# EAGLE design stepper_driver2 (EAGLE 6.4)
stepper conroller with 2 counting bits for unipolar stepper motor
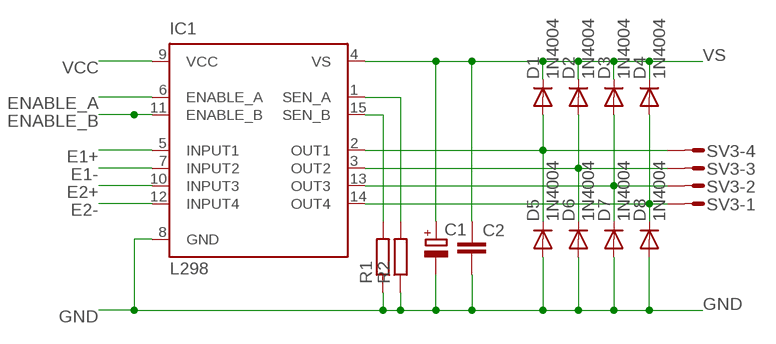
[diagram p0: schematic, sheet 1]

## Parts
C1  CPOL-EUE3.5-10  [E3,5-10]
C2  C-EU050-025X075  [C050-025X075]
D1  1N4004  [DO41-10]
D2  1N4004  [DO41-10]
D3  1N4004  [DO41-10]
D4  1N4004  [DO41-10]
D5  1N4004  [DO41-10]
D6  1N4004  [DO41-10]
D7  1N4004  [DO41-10]
D8  1N4004  [DO41-10]
IC1  L298  [MULTIWATT-15]
R1  R-EU_0207/15  [0207/15]
R2  R-EU_0207/15  [0207/15]
SV3  S04P  [S04P]

## Nets
A1+: D1.A D5.C IC1.2(OUT1) SV3.4
A1-: D2.A D6.C IC1.3(OUT2) SV3.3
A2+: D3.A D7.C IC1.13(OUT3) SV3.2
A2-: D4.A D8.C IC1.14(OUT4) SV3.1
E1+: IC1.5(INPUT1)
E1-: IC1.7(INPUT2)
E2+: IC1.10(INPUT3)
E2-: IC1.12(INPUT4)
ENABLE_A: IC1.6(ENABLE_A)
ENABLE_B: IC1.11(ENABLE_B)
GND: C1.- C2.2 D5.A D6.A D7.A D8.A IC1.8(GND) R1.1 R2.1
N$6: IC1.15(SEN_B) R1.2
N$7: IC1.1(SEN_A) R2.2
VCC: IC1.9(VCC)
VS: C1.+ C2.1 D1.C D2.C D3.C D4.C IC1.4(VS)

## Library data of the parts
C1 = rcl:CPOL-EU: POLARIZED CAPACITOR, European symbol
C2 = rcl:C-EU: CAPACITOR, European symbol
D1-D8 = diode:1N4004: DIODE general purpose rectifier, 1 A
IC1 = st-microelectronics:L298: DUAL FULL-BRIDGE DRIVER; MPN: L298N; OC_FARNELL: 1589425; OC_NEWARK: 32M1527
R1 R2 = rcl:R-EU_: RESISTOR, European symbol
SV3 = con-amp-mt:S04P: AMP MT CONNECTOR; OC_FARNELL: unknown; OC_NEWARK: unknown

## Board
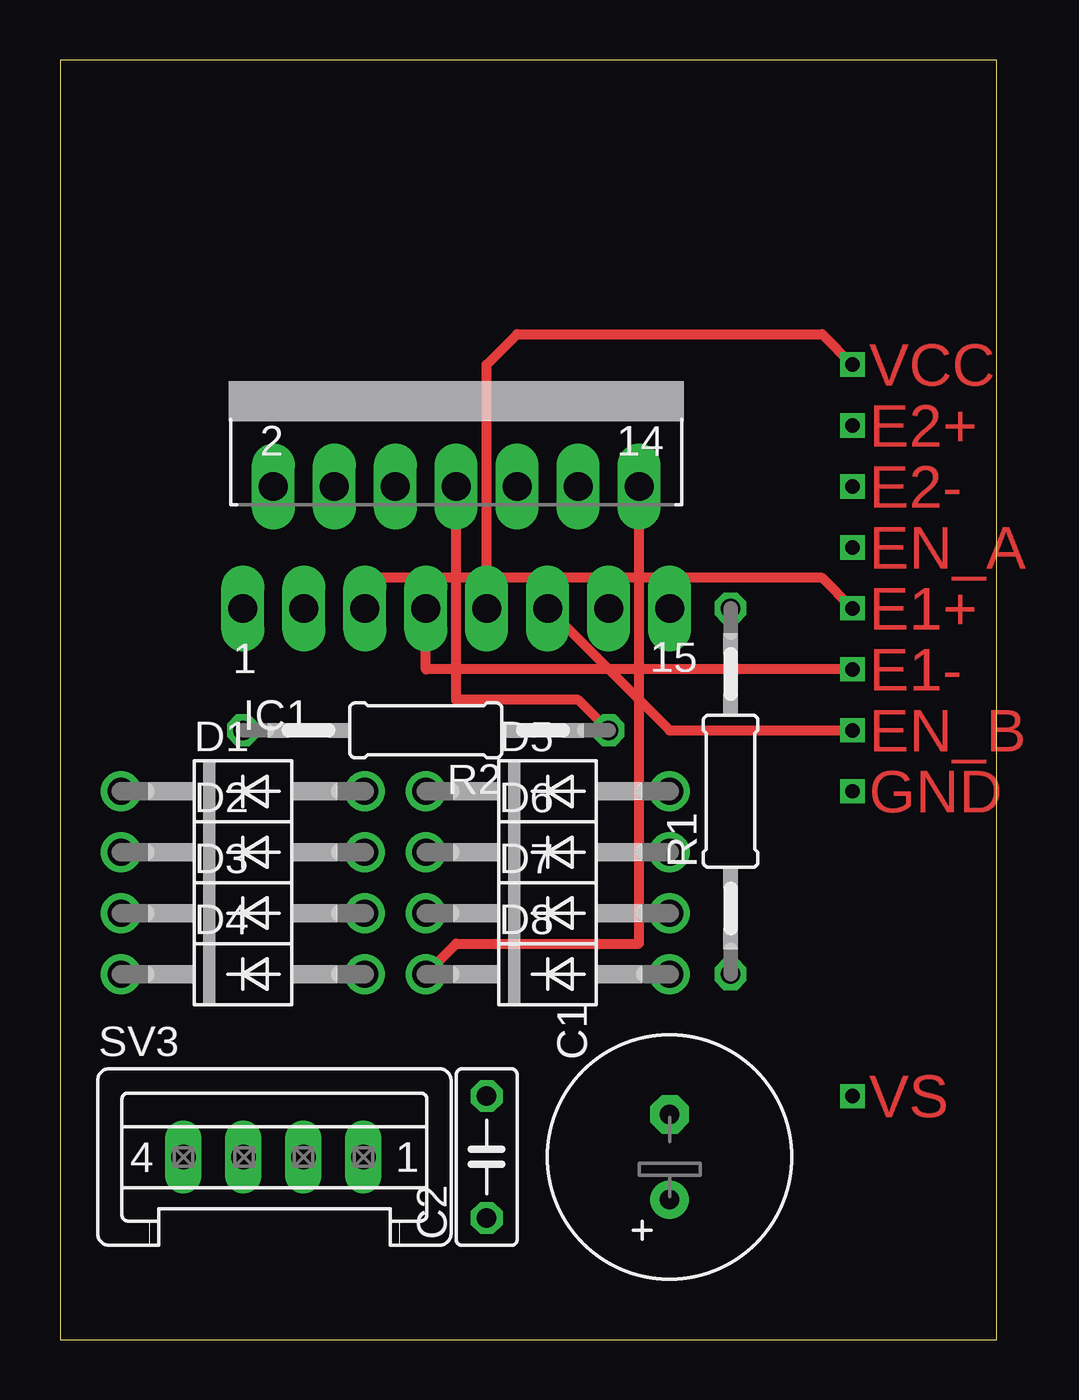
[diagram p1: board, top side]
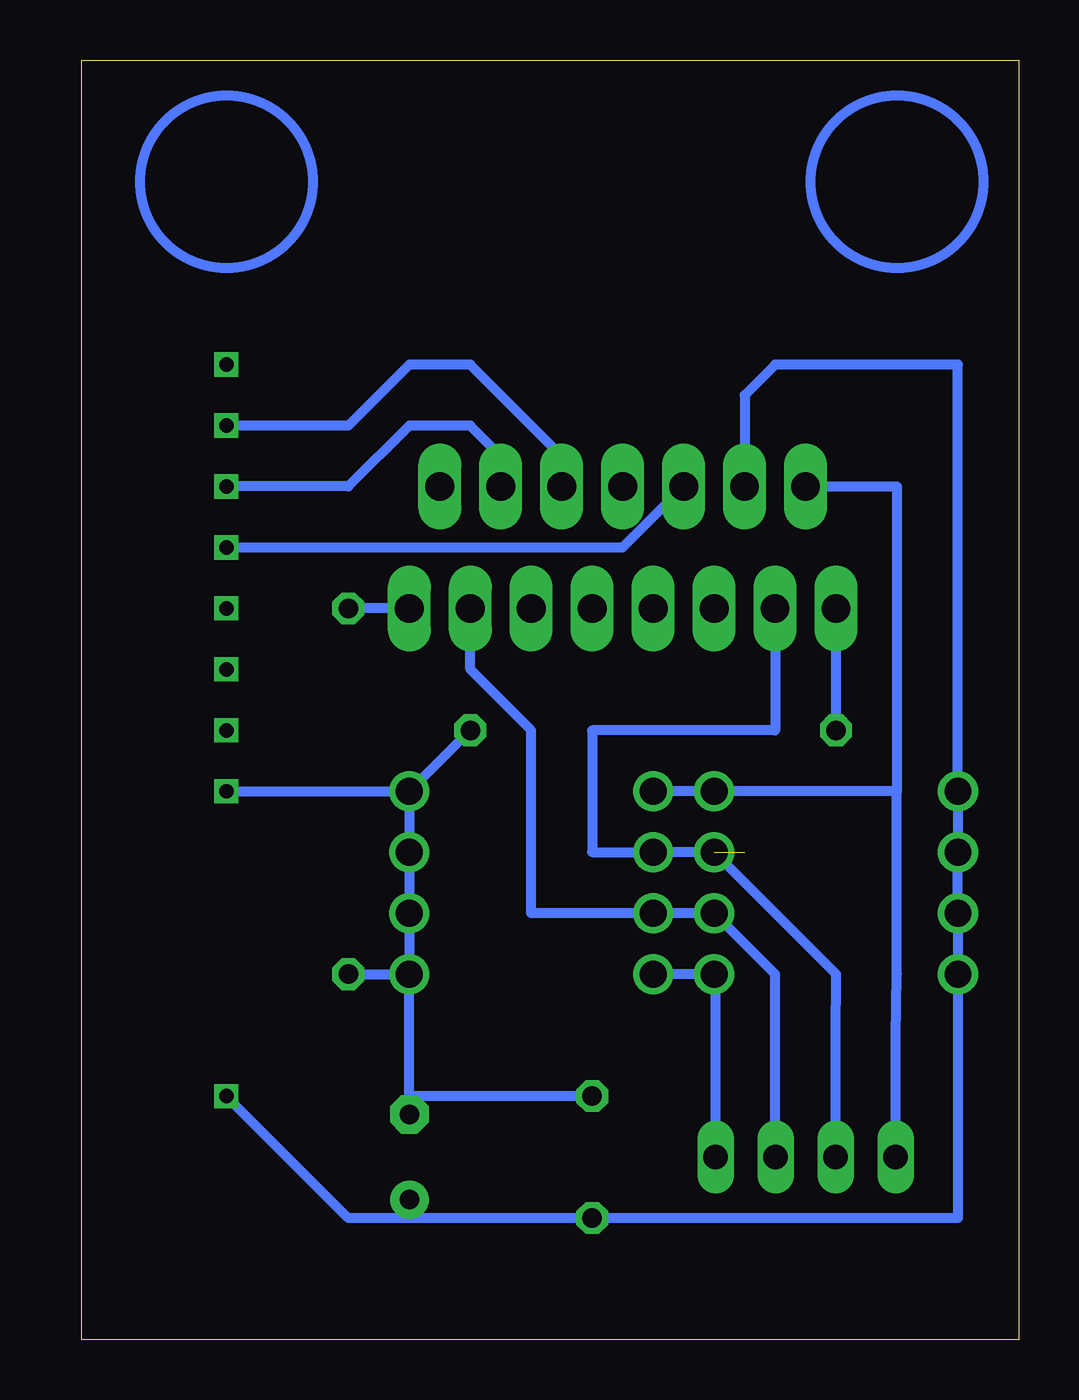
[diagram p2: board, bottom side, seen from below]

Size 39.04 x 53.33 mm. Coordinates in mm from the lower left corner, seen from the top.
Outline: 0,0 39.04,0 39.04,53.33 0,53.33 0,0
Copper layers (1*16): Top 0.035mm / dielectric 1.5mm / Bottom 0.035mm
Design rules "default": minimum track width 10mil, minimum drill 24mil, track to track 8mil, track to pad 8mil, pad to pad 8mil, via to via 8mil, smd to smd 8mil, copper to edge 40mil, drill to drill 8mil, minimum pad ring 10mil, minimum via ring 8mil, stop-mask expansion 4mil, vias tented up to drill 0mil, thermal gap 10mil

### Footprints (pad centres in the part's own frame; a part is rotated, then mirrored left to right if it is on the bottom)
E3,5-10 = drill 0.813 pad 1.6: + -1.778,0 | drill 0.813 pad 1.6 octagon: - 1.778,0
C050-025X075 = drill 0.813 octagon: 1 -2.54,0; 2 2.54,0
DO41-10 = drill 1.118: A 5.08,0; C -5.08,0
MULTIWATT-15 = drill 1.2 long: 1 -8.89,-7.62; 2 -7.62,-2.54; 3 -6.35,-7.62; 4 -5.08,-2.54; 5 -3.81,-7.62; 6 -2.54,-2.54; 7 -1.27,-7.62; 8 0,-2.54; 9 1.27,-7.62; 10 2.54,-2.54; 11 3.81,-7.62; 12 5.08,-2.54; 13 6.35,-7.62; 14 7.62,-2.54; 15 8.89,-7.62
0207/15 = drill 0.813 octagon: 1 -7.62,0; 2 7.62,0
S04P = drill 1.016 long: 1 3.75,0; 2 1.25,0; 3 -1.25,0; 4 -3.75,0

### Placement (x,y rotation side)
C1  25.4,7.62 90 top
C2  17.78,7.62 90 top
D1  7.62,22.86 0 top
D2  7.62,20.32 0 top
D3  7.62,17.78 0 top
D4  7.62,15.24 0 top
D5  20.32,22.86 0 top
D6  20.32,20.32 0 top
D7  20.32,17.78 0 top
D8  20.32,15.24 0 top
IC1  16.51,38.1 0 top
R1  27.94,22.86 90 top
R2  15.24,25.4 180 top
SV3  8.89,7.62 0 top

### Tracks (layer width: path | path; a pad name or v marks a point on that pad's centre or on a via)
A1+
  Bottom 0.406: D5.C D1.A 5.08,22.86 | SV3.4 5.14,12.64 5.08,15.24 5.08,22.86 | IC1.2 5.08,35.56 5.08,22.86
A1-  (1 unrouted)
  Bottom 0.406: SV3.3 7.64,12.68 7.62,15.24 D2.A D6.C 17.78,20.32 17.78,25.4 10.16,25.4 IC1.3
A2+
  Bottom 0.406: SV3.2 10.16,10.16 10.16,15.24 D3.A D7.C 20.32,17.78 20.32,25.4 22.86,27.94 IC1.13
A2-
  Top 0.406: D8.C 16.51,16.51 24.13,16.51 IC1.14
  Bottom 0.406: 15.18,15.18 D8.C D4.A 12.64,15.18 SV3.1
E1+  (via drill 0.6)
  Top 0.406: v33.02,30.48 31.75,31.75 12.7,31.75 IC1.5
E1-  (via drill 0.6)
  Top 0.406: v33.02,27.94 15.24,27.94 IC1.7
E2+  (via drill 0.6)
  Bottom 0.406: IC1.10 19.05,36.83 22.86,40.64 25.4,40.64 27.94,38.1 v33.02,38.1
E2-  (via drill 0.6)
  Bottom 0.406: IC1.12 21.59,36.83 22.86,38.1 25.4,38.1 27.94,35.56 v33.02,35.56
ENABLE_A  (via drill 0.6)
  Bottom 0.406: v33.02,33.02 16.51,33.02 IC1.6
ENABLE_B  (via drill 0.6)
  Top 0.406: IC1.11 25.4,25.4 v33.02,25.4
GND  (via drill 0.6)
  Top 0.406: R2.1 21.59,26.67 16.51,26.67 IC1.8
  Bottom 0.406: D5.A D6.A D7.A D8.A | R1.1 D8.A | C1.- 25.4,10.16 | 25.4,10.16 D8.A | R2.1 D5.A | C2.2 25.4,10.16 | v33.02,22.86 D5.A
N$6
  Bottom 0.406: IC1.15 R1.2
N$7
  Bottom 0.406: R2.2 IC1.1
VCC  (via drill 0.6)
  Top 0.406: IC1.9 17.78,40.64 19.05,41.91 31.75,41.91 v33.02,40.64
VS  (via drill 0.6)
  Bottom 0.406: IC1.4 11.43,39.37 10.16,40.64 2.54,40.64 D1.C D2.C D3.C D4.C 2.54,5.08 C2.1 25.4,5.08 | C1.+ 25.4,5.08 | 25.4,5.08 27.94,5.08 v33.02,10.16
(copper drawn outside any net)
  shapes: Bottom circle x2

### Text on the board
Top: VCC | E2+ | E2- | EN_A | E1+ | E1- | EN_B | GND | VS